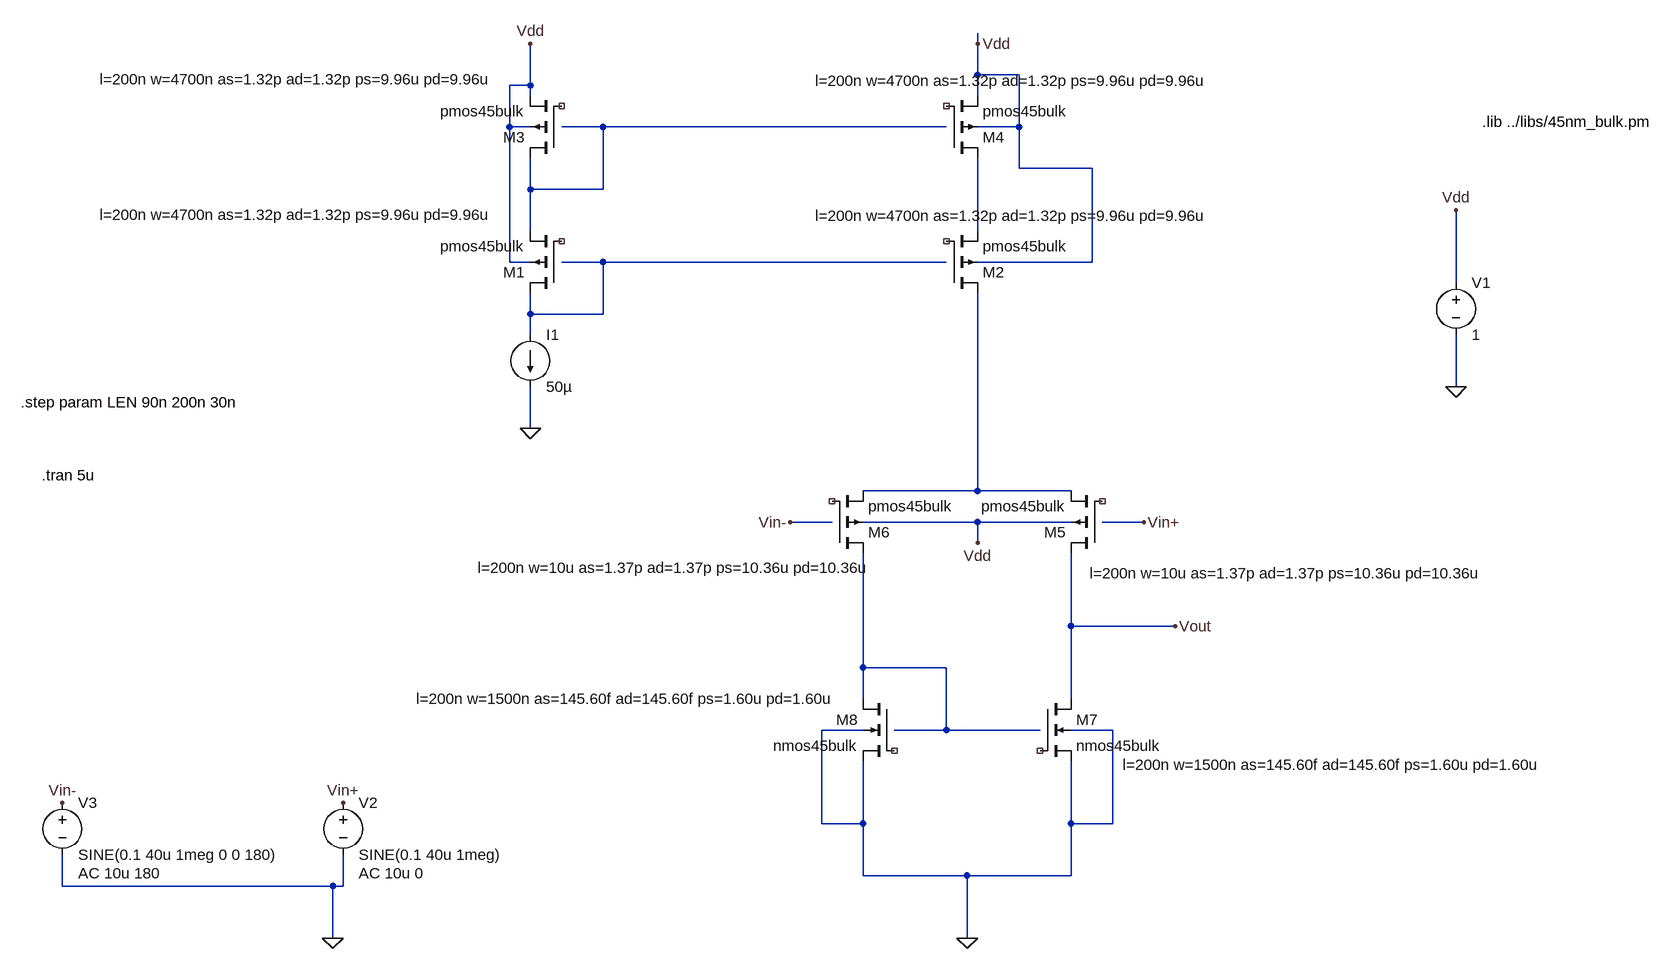
[diagram p0: schematic Draft2.asc]
Draft2.asc, the LTspice schematic file:
Version 4
SHEET 1 1300 804
WIRE 224 -592 224 -608
WIRE 224 -544 224 -592
WIRE 288 -544 224 -544
WIRE -464 -528 -464 -592
WIRE -464 -528 -496 -528
WIRE -464 -512 -464 -528
WIRE 224 -512 224 -544
WIRE -496 -464 -496 -528
WIRE -464 -464 -496 -464
WIRE -352 -464 -416 -464
WIRE 176 -464 -352 -464
WIRE 288 -464 288 -544
WIRE 288 -464 224 -464
WIRE 288 -400 288 -464
WIRE 400 -400 288 -400
WIRE -464 -368 -464 -416
WIRE -352 -368 -352 -464
WIRE -352 -368 -464 -368
WIRE -464 -304 -464 -368
WIRE 224 -304 224 -416
WIRE -496 -256 -496 -464
WIRE -464 -256 -496 -256
WIRE -352 -256 -416 -256
WIRE 176 -256 -352 -256
WIRE 400 -256 400 -400
WIRE 400 -256 224 -256
WIRE 960 -224 960 -336
WIRE -464 -176 -464 -208
WIRE -352 -176 -352 -256
WIRE -352 -176 -464 -176
WIRE -464 -144 -464 -176
WIRE 960 -64 960 -144
WIRE -464 0 -464 -64
WIRE 224 96 224 -208
WIRE 224 96 48 96
WIRE 368 96 224 96
WIRE 0 144 -64 144
WIRE 224 144 48 144
WIRE 368 144 224 144
WIRE 480 144 416 144
WIRE 224 176 224 144
WIRE 368 304 368 192
WIRE 528 304 368 304
WIRE 48 368 48 192
WIRE 176 368 48 368
WIRE 48 416 48 368
WIRE 368 416 368 304
WIRE 48 464 -16 464
WIRE 176 464 176 368
WIRE 176 464 96 464
WIRE 320 464 176 464
WIRE 432 464 368 464
WIRE -16 608 -16 464
WIRE 48 608 48 512
WIRE 48 608 -16 608
WIRE 368 608 368 512
WIRE 432 608 432 464
WIRE 432 608 368 608
WIRE 48 688 48 608
WIRE 208 688 48 688
WIRE 368 688 368 608
WIRE 368 688 208 688
WIRE -1184 704 -1184 656
WIRE -768 704 -1184 704
WIRE -752 704 -752 656
WIRE -752 704 -768 704
WIRE -768 784 -768 704
WIRE 208 784 208 688
FLAG -464 -592 Vdd
FLAG -464 0 0
FLAG 224 -592 Vdd
FLAG 960 -64 0
FLAG 960 -336 Vdd
FLAG -64 144 Vin-
FLAG 480 144 Vin+
FLAG 208 784 0
FLAG 528 304 Vout
FLAG 224 176 Vdd
FLAG -752 576 Vin+
FLAG -1184 576 Vin-
FLAG -768 784 0
DATAFLAG 64 96 ""
DATAFLAG 432 304 ""
DATAFLAG 192 464 ""
SYMBOL pmos4 -416 -208 R180
WINDOW 123 99 121 Left 2
SYMATTR Value2 l=200n w=4700n as=1.32p ad=1.32p ps=9.96u pd=9.96u
SYMATTR InstName M1
SYMATTR Value pmos45bulk
SYMBOL current -464 -144 R0
WINDOW 123 0 0 Left 0
WINDOW 39 24 28 Left 2
SYMATTR InstName I1
SYMATTR Value 50µ
SYMBOL pmos4 176 -208 M180
WINDOW 123 -202 119 Left 2
SYMATTR Value2 l=200n w=4700n as=1.32p ad=1.32p ps=9.96u pd=9.96u
SYMATTR InstName M2
SYMATTR Value pmos45bulk
SYMBOL voltage 960 -240 R0
WINDOW 123 0 0 Left 0
WINDOW 39 0 0 Left 0
SYMATTR InstName V1
SYMATTR Value 1
SYMBOL pmos4 -416 -416 R180
WINDOW 123 99 121 Left 2
SYMATTR Value2 l=200n w=4700n as=1.32p ad=1.32p ps=9.96u pd=9.96u
SYMATTR InstName M3
SYMATTR Value pmos45bulk
SYMBOL pmos4 176 -416 M180
WINDOW 123 -202 119 Left 2
SYMATTR Value2 l=200n w=4700n as=1.32p ad=1.32p ps=9.96u pd=9.96u
SYMATTR InstName M4
SYMATTR Value pmos45bulk
SYMBOL pmos4 416 192 R180
WINDOW 123 -592 -31 Left 2
SYMATTR Value2 l=200n w=10u as=1.37p ad=1.37p ps=10.36u pd=10.36u
SYMATTR InstName M5
SYMATTR Value pmos45bulk
SYMBOL pmos4 0 192 M180
WINDOW 123 -545 -22 Left 2
SYMATTR Value2 l=200n w=10u as=1.37p ad=1.37p ps=10.36u pd=10.36u
SYMATTR InstName M6
SYMATTR Value pmos45bulk
SYMBOL nmos4 320 416 R0
WINDOW 123 127 101 Left 2
SYMATTR Value2 l=200n w=1500n as=145.60f ad=145.60f ps=1.60u pd=1.60u
SYMATTR InstName M7
SYMATTR Value nmos45bulk
SYMBOL nmos4 96 416 M0
WINDOW 123 84 0 Left 2
SYMATTR Value2 l=200n w=1500n as=145.60f ad=145.60f ps=1.60u pd=1.60u
SYMATTR InstName M8
SYMATTR Value nmos45bulk
SYMBOL voltage -752 560 R0
WINDOW 123 24 124 Left 2
WINDOW 39 0 0 Left 0
SYMATTR Value2 AC 10u 0
SYMATTR InstName V2
SYMATTR Value SINE(0.1 40u 1meg)
SYMBOL voltage -1184 560 R0
WINDOW 123 24 124 Left 2
WINDOW 39 0 0 Left 0
SYMATTR Value2 AC 10u 180
SYMATTR InstName V3
SYMATTR Value SINE(0.1 40u 1meg 0 0 180)
TEXT 1000 -472 Left 2 !.lib ../libs/45nm_bulk.pm
TEXT -1216 72 Left 2 !.tran 5u
TEXT -1248 -40 Left 2 !.step param LEN 90n 200n 30n

The netlist it stands for:
* Draft2.asc
* M1: pmos45bulk l=200n w=4700n as=1.32p ad=1.32p ps=9.96u pd=9.96u (symbol pmos4 not certain, pin order unknown); nets seen at it: N001, N003, Vdd
I1 N003 0 50µ
* M2: pmos45bulk l=200n w=4700n as=1.32p ad=1.32p ps=9.96u pd=9.96u (symbol pmos4 not certain, pin order unknown); nets seen at it: N002, N004, Vdd
V1 Vdd 0 1
* M3: pmos45bulk l=200n w=4700n as=1.32p ad=1.32p ps=9.96u pd=9.96u (symbol pmos4 not certain, pin order unknown); nets seen at it: N001, Vdd
* M4: pmos45bulk l=200n w=4700n as=1.32p ad=1.32p ps=9.96u pd=9.96u (symbol pmos4 not certain, pin order unknown); nets seen at it: N002, Vdd
* M5: pmos45bulk l=200n w=10u as=1.37p ad=1.37p ps=10.36u pd=10.36u (symbol pmos4 not certain, pin order unknown); nets seen at it: N004, Vdd, Vout
* M6: pmos45bulk l=200n w=10u as=1.37p ad=1.37p ps=10.36u pd=10.36u (symbol pmos4 not certain, pin order unknown); nets seen at it: N004, N005, Vdd
* M7: nmos45bulk l=200n w=1500n as=145.60f ad=145.60f ps=1.60u pd=1.60u (symbol nmos4 not certain, pin order unknown); nets seen at it: 0, Vout
* M8: nmos45bulk l=200n w=1500n as=145.60f ad=145.60f ps=1.60u pd=1.60u (symbol nmos4 not certain, pin order unknown); nets seen at it: 0, N005
V2 Vin+ 0 SINE(0.1 40u 1meg) AC 10u 0
V3 Vin- 0 SINE(0.1 40u 1meg 0 0 180) AC 10u 180
.lib ../libs/45nm_bulk.pm
.tran 5u
.step param LEN 90n 200n 30n
.backanno
.end